# EAGLE schematic esp8266-hw8 (EAGLE 9.5.2)
ESP8266 HW
CNAME: Sensorboard; CREVISION: HW8.2; DESIGNER: Pär Sundbäck
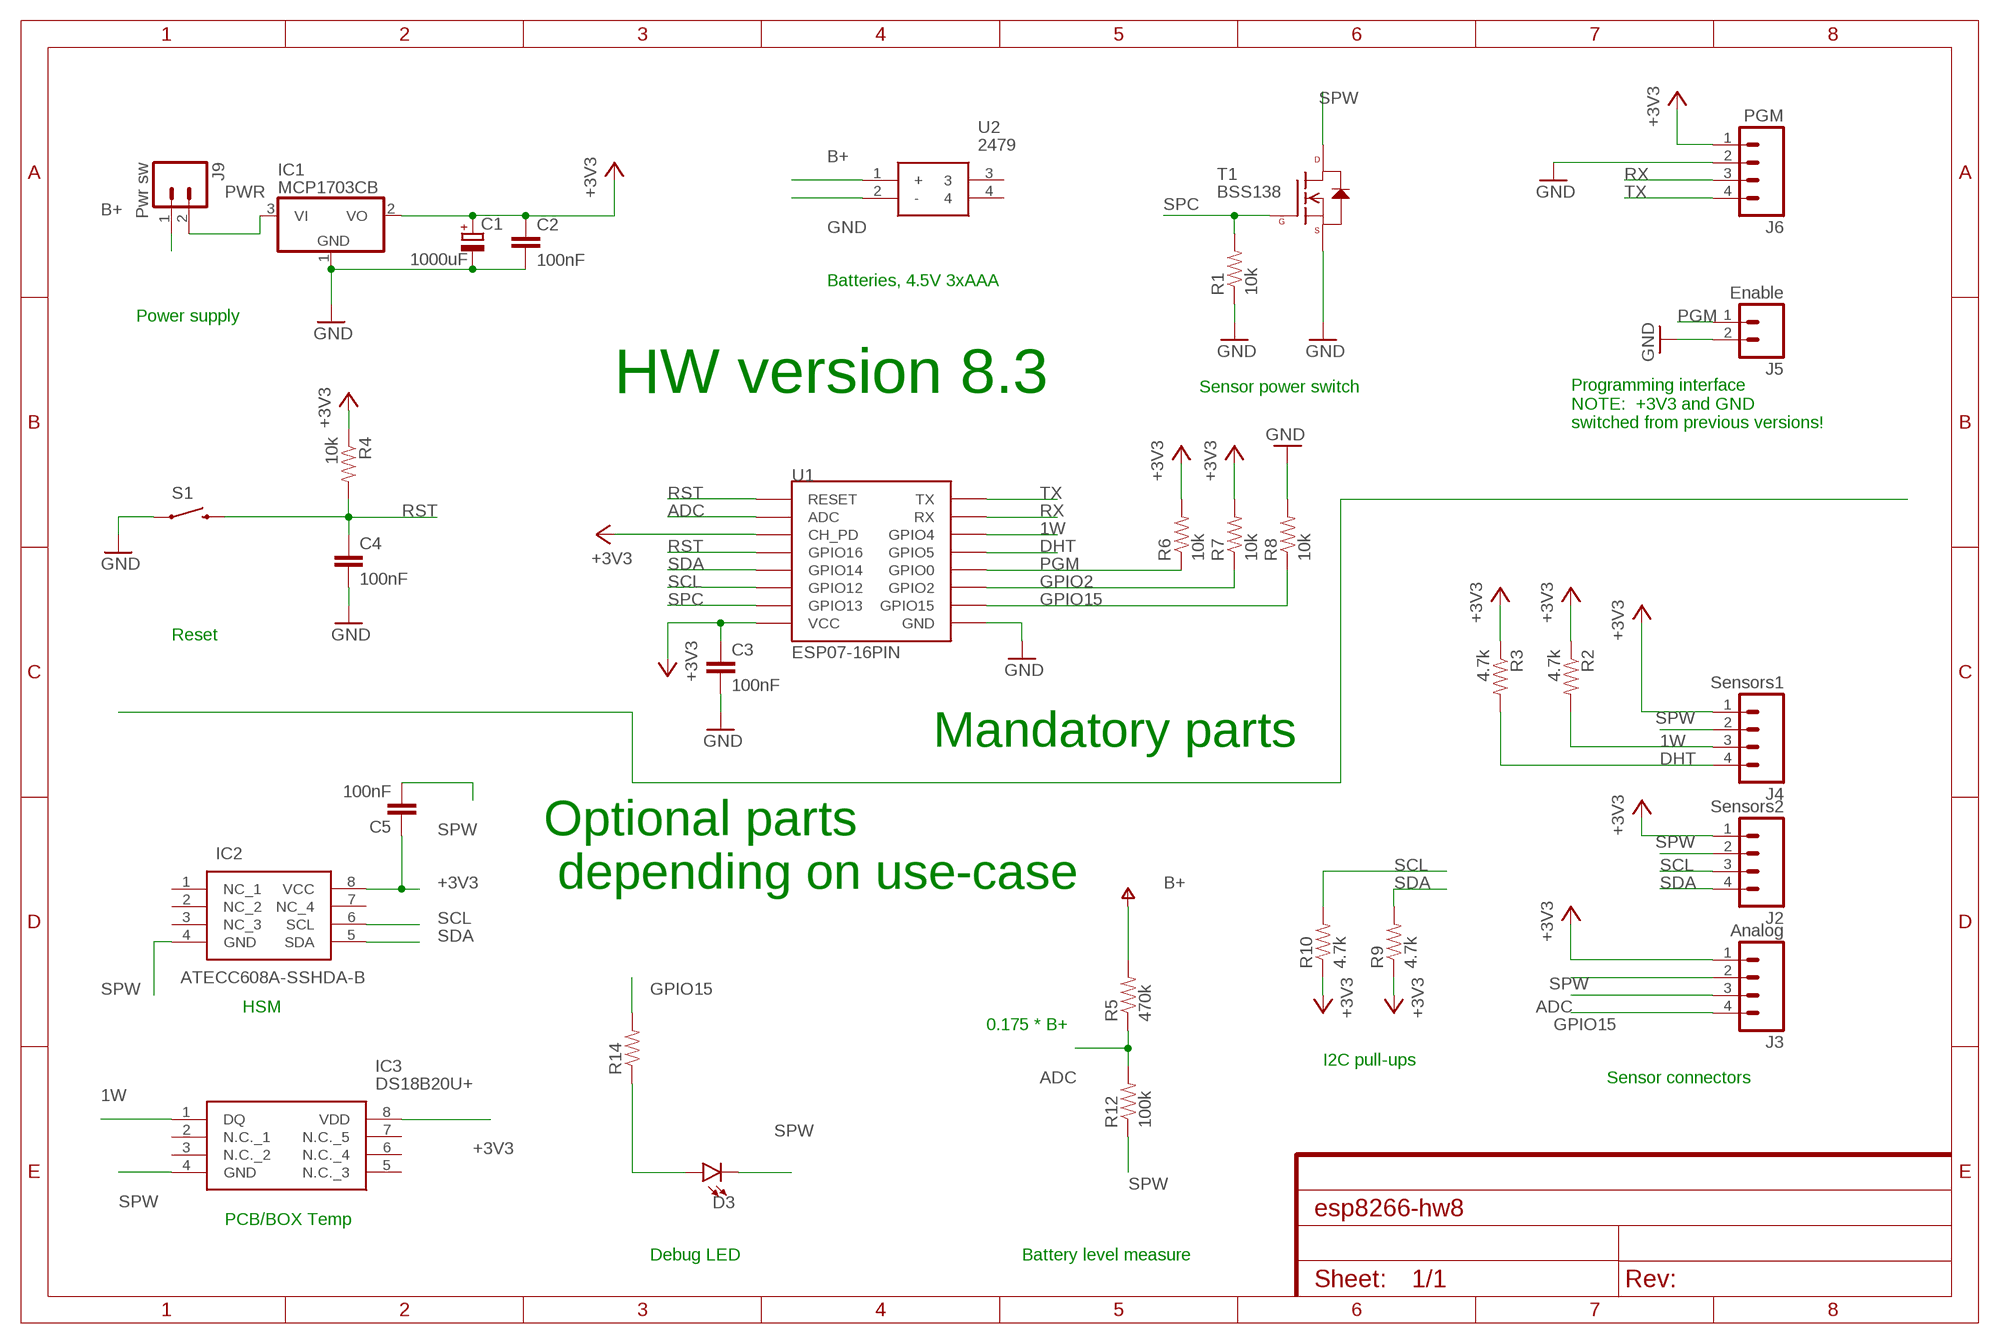
[diagram p0: schematic, sheet 1]

## Parts
C1  1000uF  CPOL-EUE3.5-8  [E3,5-8]
C2  100nF  CAP0805  [0805]
C3  100nF  CAP0805  [0805]
C4  100nF  CAP0805  [0805]
C5  100nF  CAP0805  [0805]
D3  LED3MM  [LED_3MM]
IC1  MCP1703CB  [SOT23]
IC2  ATECC608A-SSHDA-B  [SOIC127P600X175-8N]
IC3  DS18B20U+  [SOP65P490X110-8N]
J2  Sensors2  M04PTH  [1X04]
J3  Analog  M04PTH  [1X04]
J4  Sensors1  M04PTH  [1X04]
J5  Enable  M02PTH  [1X02]
J6  PGM  M04PTH  [1X04]
J9  Pwr sw  M02PTH  [1X02]
R1  10k  RESISTOR0805-RES  [0805]
R2  4.7k  RESISTOR0805-RES  [0805]
R3  4.7k  RESISTOR0805-RES  [0805]
R4  10k  RESISTOR0805-RES  [0805]
R5  470k  RESISTOR0805-RES  [0805]
R6  10k  RESISTOR0805-RES  [0805]
R7  10k  RESISTOR0805-RES  [0805]
R8  10k  RESISTOR0805-RES  [0805]
R9  4.7k  RESISTOR0805-RES  [0805]
R10  4.7k  RESISTOR0805-RES  [0805]
R12  100k  RESISTOR0805-RES  [0805]
R14  470  RESISTOR0805-RES  [0805]
S1  RESET  SWITCH-MOMENTARY-2SMD-1101NE  [TACTILE-SWITCH-1101NE]
T1  BSS138  N-CHANNEL-MOSFET-BSS138  [SOT23-3]
U1  ESP07-16PIN  [ESP07-16PIN]
U2  2479  [2479]

## Nets
1W: IC3.1(DQ) J4.3 R2.2 U1.GPIO4
+3V3: C1.+ C2.1 C3.1 C5.1 IC1.2(VO) IC2.8(VCC) IC3.8(VDD) J2.1 J3.1 J4.1 J6.1 R2.1 R3.1 R4.1 R6.2 R7.2 R9.1 R10.1 U1.CH_PD U1.VCC
ADC: J3.3 R5.1 R12.2 U1.ADC
B+: J9.1 R5.2 U2.1(+) ; supply symbol labelled V+
DHT: J4.4 R3.2 U1.GPIO5
GND: C1.- C2.2 C3.2 C4.2 IC1.1(GND) J5.2 J6.2 R1.1 R8.2 S1.1 T1.2(S) U1.GND U2.2(-)
GPIO2: R7.1 U1.GPIO2
GPIO15: J3.4 R8.1 R14.2 U1.GPIO15
N$8: D3.A R14.1
PGM: J5.1 R6.1 U1.GPIO0
PWR: IC1.3(VI) J9.2
RST: C4.1 R4.2 S1.2 U1.GPIO16 U1.REST(RESET)
RX: J6.3 U1.RX
SCL: IC2.6(SCL) J2.3 R10.2 U1.GPIO12
SDA: IC2.5(SDA) J2.4 R9.2 U1.GPIO14
SPC: R1.2 T1.1(G) U1.GPIO13
SPW: C5.2 D3.K(C) IC2.4(GND) IC3.4(GND) J2.2 J3.2 J4.2 R12.1 T1.3(D)
TX: J6.4 U1.TX
Unconnected: IC2.1(NC_1) IC2.2(NC_2) IC2.3(NC_3) IC2.7(NC_4) IC3.2(N.C._1) IC3.3(N.C._2) IC3.5(N.C._3) IC3.6(N.C._4) IC3.7(N.C._5) U2.3 U2.4

## Notes on the sheet
- Batteries, 4.5V 3xAAA
- Power supply
- HW version 8.3 | Sensor power switch
- Programming interface
  NOTE:  +3V3 and GND 
  switched from previous versions!
- Reset
- Mandatory parts
- Optional parts
   depending on use-case
- HSM
- 0.175 * B+
- I2C pull-ups
- Sensor connectors
- PCB/BOX Temp
- Debug LED | Battery level measure

## Library data of the parts
C1 = rcl:CPOL-EU: POLARIZED CAPACITOR, European symbol; SPICEPREFIX: C
C2-C5 = SparkFun-Passives:CAP: Capacitor Standard 0603 ceramic capacitor, and 0.1" leaded capacitor.
D3 = SparkFun-LED:LED: LED (Generic) Standard schematic elements and footprints for 5mm, 3mm, 1206, and 0603 sized LEDs. Generic LEDs with no color specified.; PROD_ID: DIO-08794
IC1 = linear:MCP1703: 250 mA, 16V, Low Quiescent Current LDO Regulator Source: http://ww1.microchip.com/downloads/en/DeviceDoc/22049b.pdf
IC2 = SamacSys_Parts:ATECC608A-SSHDA-B: Cryptoathentication ECC608A SOIC Source: Datasheet <https://componentsearchengine.com/Datasheets/1/ATECC608A-SSHDA-B.pdf>; DESCRIPTION: Cryptoathentication ECC608A SOIC; HEIGHT: 1.75mm; MANUFACTURER_NAME: Microchip; MANUFACTURER_PART_NUMBER: ATECC608A-SSHDA-B; MOUSER_PART_NUMBER: 556-ATECC608ASSHDAB; MOUSER_PRICE-STOCK: https://www.mouser.com/Search/Refine.aspx?Keyword=556-ATECC608ASSHDAB
IC3 = SamacSys_Parts:DS18B20U+: Board Mount Temperature Sensors Prgmble Resolution 1-Wire Parasite Pwr Source: Datasheet <https://componentsearchengine.com/Datasheets/1/DS18B20U .pdf>; DESCRIPTION: Board Mount Temperature Sensors Prgmble Resolution 1-Wire Parasite Pwr; HEIGHT: 1.1mm; MANUFACTURER_NAME: Maxim Integrated; MANUFACTURER_PART_NUMBER: DS18B20U+; MOUSER_PART_NUMBER: 700-DS18B20U; MOUSER_PRICE-STOCK: https://www.mouser.com/Search/Refine.aspx?Keyword=700-DS18B20U
J2-J4 J6 = SparkFun-Connectors:M04: Header 4 Standard 4-pin 0.1" header. Use with straight break away headers (SKU : PRT-00116), right angle break away headers (PRT-00553), swiss pins (PRT-00743), machine pins (PRT-00117), and female headers (PRT-00115). Molex polarized connector foot print use with SKU : PRT-08231 with associated crimp pins and housings. 1MM SMD Version SKU: PRT-10208; PROD_ID: CONN-09696
J5 J9 = SparkFun-Connectors:M02: Standard 2-pin 0.1" header. Use with - straight break away headers ( PRT-00116) - right angle break away headers (PRT-00553) - swiss pins (PRT-00743) - machine pins (PRT-00117) - female headers (PRT-00115) Molex polarized connector foot print use with: PRT-08233 with associated crimp pins and housings. 2.54_SCREWTERM for use with PRT-10571. 3.5mm Screw Terminal footprints for PRT-08084 5mm Screw Terminal footprints for use with PRT-08432
R1-R10 R12 R14 = SparkFun-Resistors:RESISTOR: Resistor Basic schematic elements and footprints for 0603, 1206, and PTH resistors.
S1 = SparkFun-Electromechanical:SWITCH-MOMENTARY-2: Various NO switches- pushbuttons, reed, etc; PROD_ID: SWCH-00815
T1 = GeekAmmo:N-CHANNEL-MOSFET: N-Channel MOSFET Mode Field Effect Transistor; DATASHEET: http://www.fairchildsemi.com/ds/BS/BSS138.pdf; DIGIKEY: BSS138TR-ND; ELEMENT14: 2323154; URL: http://au.element14.com/fairchild-semiconductor/bss138/mosfet-n-ch-50v-220ma-sot-23/dp/2323154
U1 = esp8266modules:ESP07-16PIN: ESP8266 Wifi module 07 - 16 pins; DIMENSIONS: 22.0 x 16.0 mm; PINS: 16; PITCH: 0.078" / 2 mm
U2 = SamacSys_Parts:2479: KEYSTONE - 2479 - BATTERY HOLDER, AAA, 3WAY Source: Datasheet <https://componentsearchengine.com/Datasheets/1/2479.pdf>; DESCRIPTION: KEYSTONE - 2479 - BATTERY HOLDER, AAA, 3WAY; HEIGHT: 13mm; MANUFACTURER_NAME: Keystone Electronics; MANUFACTURER_PART_NUMBER: 2479; MOUSER_PART_NUMBER: 534-2479; MOUSER_PRICE-STOCK: https://www.mouser.com/Search/Refine.aspx?Keyword=534-2479